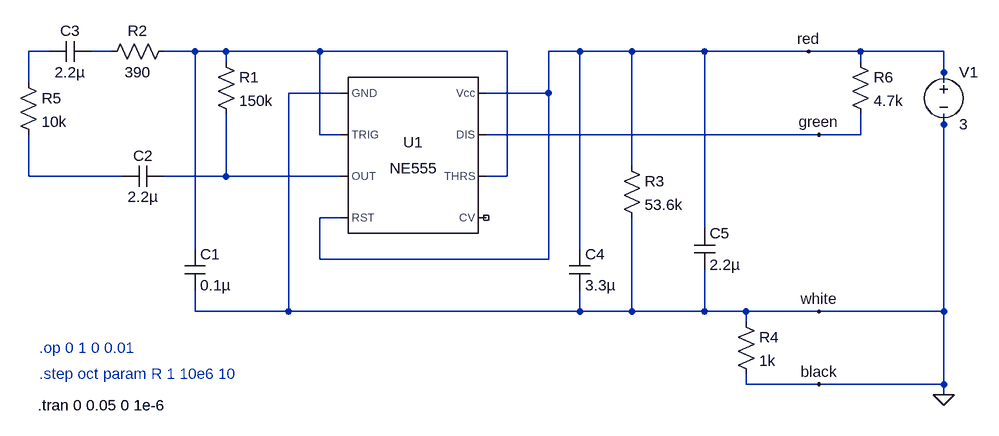
[diagram p0: schematic SMX_simulation.asc]
SMX_simulation.asc, the LTspice schematic file:
Version 4
SHEET 1 1128 680
WIRE -368 16 -400 16
WIRE -272 16 -304 16
WIRE -144 16 -192 16
WIRE -96 16 -144 16
WIRE 48 16 -96 16
WIRE 336 16 48 16
WIRE 448 16 400 16
WIRE 528 16 448 16
WIRE 640 16 528 16
WIRE 800 16 640 16
WIRE 880 16 800 16
WIRE 1008 16 880 16
WIRE -96 32 -96 16
WIRE 880 32 880 16
WIRE 1008 48 1008 16
WIRE -400 64 -400 16
WIRE 1008 64 1008 48
WIRE 80 80 0 80
WIRE 400 80 400 16
WIRE 400 80 304 80
WIRE 1008 128 1008 112
WIRE 48 144 48 16
WIRE 80 144 48 144
WIRE 816 144 304 144
WIRE 880 144 880 112
WIRE 880 144 816 144
WIRE 528 192 528 16
WIRE -400 208 -400 144
WIRE -256 208 -400 208
WIRE -96 208 -96 112
WIRE -96 208 -192 208
WIRE 80 208 -96 208
WIRE 336 208 336 16
WIRE 336 208 304 208
WIRE 80 272 48 272
WIRE 640 288 640 16
WIRE -144 320 -144 16
WIRE 448 320 448 16
WIRE 48 336 48 272
WIRE 400 336 400 80
WIRE 400 336 48 336
WIRE -144 416 -144 384
WIRE 0 416 0 80
WIRE 0 416 -144 416
WIRE 448 416 448 384
WIRE 448 416 0 416
WIRE 528 416 528 272
WIRE 528 416 448 416
WIRE 640 416 640 352
WIRE 640 416 528 416
WIRE 704 416 640 416
WIRE 816 416 704 416
WIRE 1008 416 1008 128
WIRE 1008 416 816 416
WIRE 704 432 704 416
WIRE 704 528 704 512
WIRE 816 528 704 528
WIRE 1008 528 1008 416
WIRE 1008 528 816 528
WIRE 1008 544 1008 528
FLAG 800 16 red
FLAG 816 144 green
FLAG 816 416 white
FLAG 816 528 black
FLAG 1008 544 0
SYMBOL Misc\\NE555 192 176 R0
SYMATTR InstName U1
SYMBOL res -112 16 R0
SYMATTR InstName R1
SYMATTR Value 150k
SYMBOL res -176 0 R90
WINDOW 0 0 56 VBottom 2
WINDOW 3 32 56 VTop 2
SYMATTR InstName R2
SYMATTR Value 390
SYMBOL res 512 176 R0
SYMATTR InstName R3
SYMATTR Value 53.6k
SYMBOL res 688 416 R0
SYMATTR InstName R4
SYMATTR Value 1k
SYMBOL cap -160 320 R0
SYMATTR InstName C1
SYMATTR Value 0.1µ
SYMBOL cap -192 192 R90
WINDOW 0 0 32 VBottom 2
WINDOW 3 32 32 VTop 2
SYMATTR InstName C2
SYMATTR Value 2.2µ
SYMBOL cap -304 0 R90
WINDOW 0 0 32 VBottom 2
WINDOW 3 32 32 VTop 2
SYMATTR InstName C3
SYMATTR Value 2.2µ
SYMBOL cap 432 320 R0
SYMATTR InstName C4
SYMATTR Value 3.3µ
SYMBOL cap 624 288 R0
SYMATTR InstName C5
SYMATTR Value 2.2µ
SYMBOL voltage 1008 32 R0
WINDOW 123 0 0 Left 0
WINDOW 39 0 0 Left 0
SYMATTR InstName V1
SYMATTR Value 3
SYMBOL res -416 48 R0
SYMATTR InstName R5
SYMATTR Value 10k
SYMBOL res 864 16 R0
SYMATTR InstName R6
SYMATTR Value 4.7k
TEXT -384 512 Left 2 ;.step oct param R 1 10e6 10
TEXT -384 472 Left 2 ;.op 0 1 0 0.01
TEXT -386 560 Left 2 !.tran 0 0.05 0 1e-6

The netlist it stands for:
* SMX_simulation.asc
XU1 0 N003 N005 red NC_01 N003 green red NE555  ; pins GND TRIG OUT RST CV THRS DIS Vcc
R1 N003 N005 150k
R2 N003 N002 390
R3 red 0 53.6k
R4 0 0 1k
C1 N003 0 0.1µ
C2 N005 N004 2.2µ
C3 N002 N001 2.2µ
C4 red 0 3.3µ
C5 red 0 2.2µ
V1 red 0 3
R5 N001 N004 10k
R6 red green 4.7k
* .step oct param R 1 10e6 10
* .op 0 1 0 0.01
.tran 0 0.05 0 1e-6
.lib NE555.sub
.backanno
.end